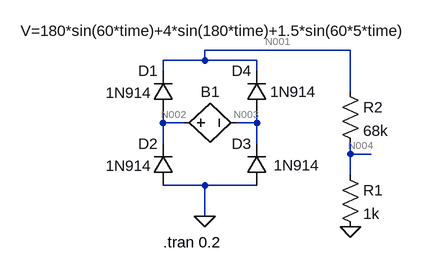
[diagram p0: schematic instrumentation.asc]
instrumentation.asc, the LTspice schematic file:
Version 4
SHEET 1 880 680
WIRE 224 -16 0 -16
WIRE 0 0 0 -16
WIRE 0 0 -64 0
WIRE 80 0 0 0
WIRE -64 16 -64 0
WIRE 80 16 80 0
WIRE 224 48 224 -16
WIRE -64 96 -64 80
WIRE -32 96 -64 96
WIRE 80 96 80 80
WIRE 80 96 48 96
WIRE -64 128 -64 96
WIRE 80 128 80 96
WIRE 224 144 224 128
WIRE 256 144 224 144
WIRE 224 176 224 144
WIRE 0 192 -64 192
WIRE 80 192 0 192
WIRE 0 240 0 192
FLAG 224 256 0
FLAG 0 240 0
SYMBOL res 208 160 R0
SYMATTR InstName R1
SYMATTR Value 1k
SYMBOL res 208 32 R0
SYMATTR InstName R2
SYMATTR Value 68k
SYMBOL bv -48 96 R270
WINDOW 3 157 63 VBottom 2
WINDOW 0 32 56 VTop 2
SYMATTR Value V=180*sin(60*time)+4*sin(180*time)+1.5*sin(60*5*time)
SYMATTR InstName B1
SYMBOL diode -48 80 R180
WINDOW 0 24 64 Left 2
WINDOW 3 33 30 Left 2
SYMATTR InstName D1
SYMATTR Value 1N914
SYMBOL diode -48 192 R180
WINDOW 0 24 64 Left 2
WINDOW 3 33 30 Left 2
SYMATTR InstName D2
SYMATTR Value 1N914
SYMBOL diode 96 192 R180
WINDOW 0 24 64 Left 2
WINDOW 3 -81 31 Left 2
SYMATTR InstName D3
SYMATTR Value 1N914
SYMBOL diode 96 80 R180
WINDOW 0 24 64 Left 2
WINDOW 3 -76 32 Left 2
SYMATTR InstName D4
SYMATTR Value 1N914
TEXT -64 280 Left 2 !.tran 0.2

The netlist it stands for:
* instrumentation.asc
R1 N004 0 1k
R2 N001 N004 68k
B1 N002 N003 V=180*sin(60*time)+4*sin(180*time)+1.5*sin(60*5*time)
D1 N002 N001 1N914
D2 0 N002 1N914
D3 0 N003 1N914
D4 N003 N001 1N914
.model D D
.lib standard.dio
.tran 0.2
.backanno
.end

* Results of the author's LTspice run, read from the files saved beside the schematic
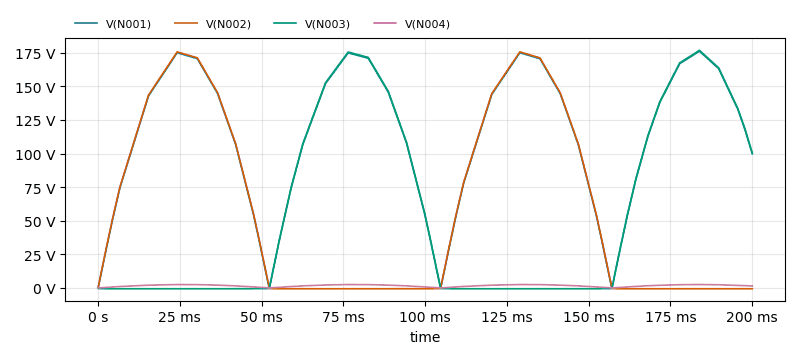
[diagram p1: Transient Analysis of instrumentation.asc, plotted from the saved traces]
* Transient Analysis, 1 run:
*   V(N001): min 0 V, max 176.1 V, average 115.9 V, rms 127.7 V, last 99.8 V
*   V(N002): min -628.1 mV, max 175.6 V, average 59.05 V, rms 91.08 V, last -601.7 mV
*   V(N003): min -627.8 mV, max 176.7 V, average 56.87 V, rms 90.24 V, last 100.4 V
*   V(N004): min 0 V, max 2.552 V, average 1.68 V, rms 1.85 V, last 1.446 V